# EAGLE design unmask (EAGLE 7.2.0)
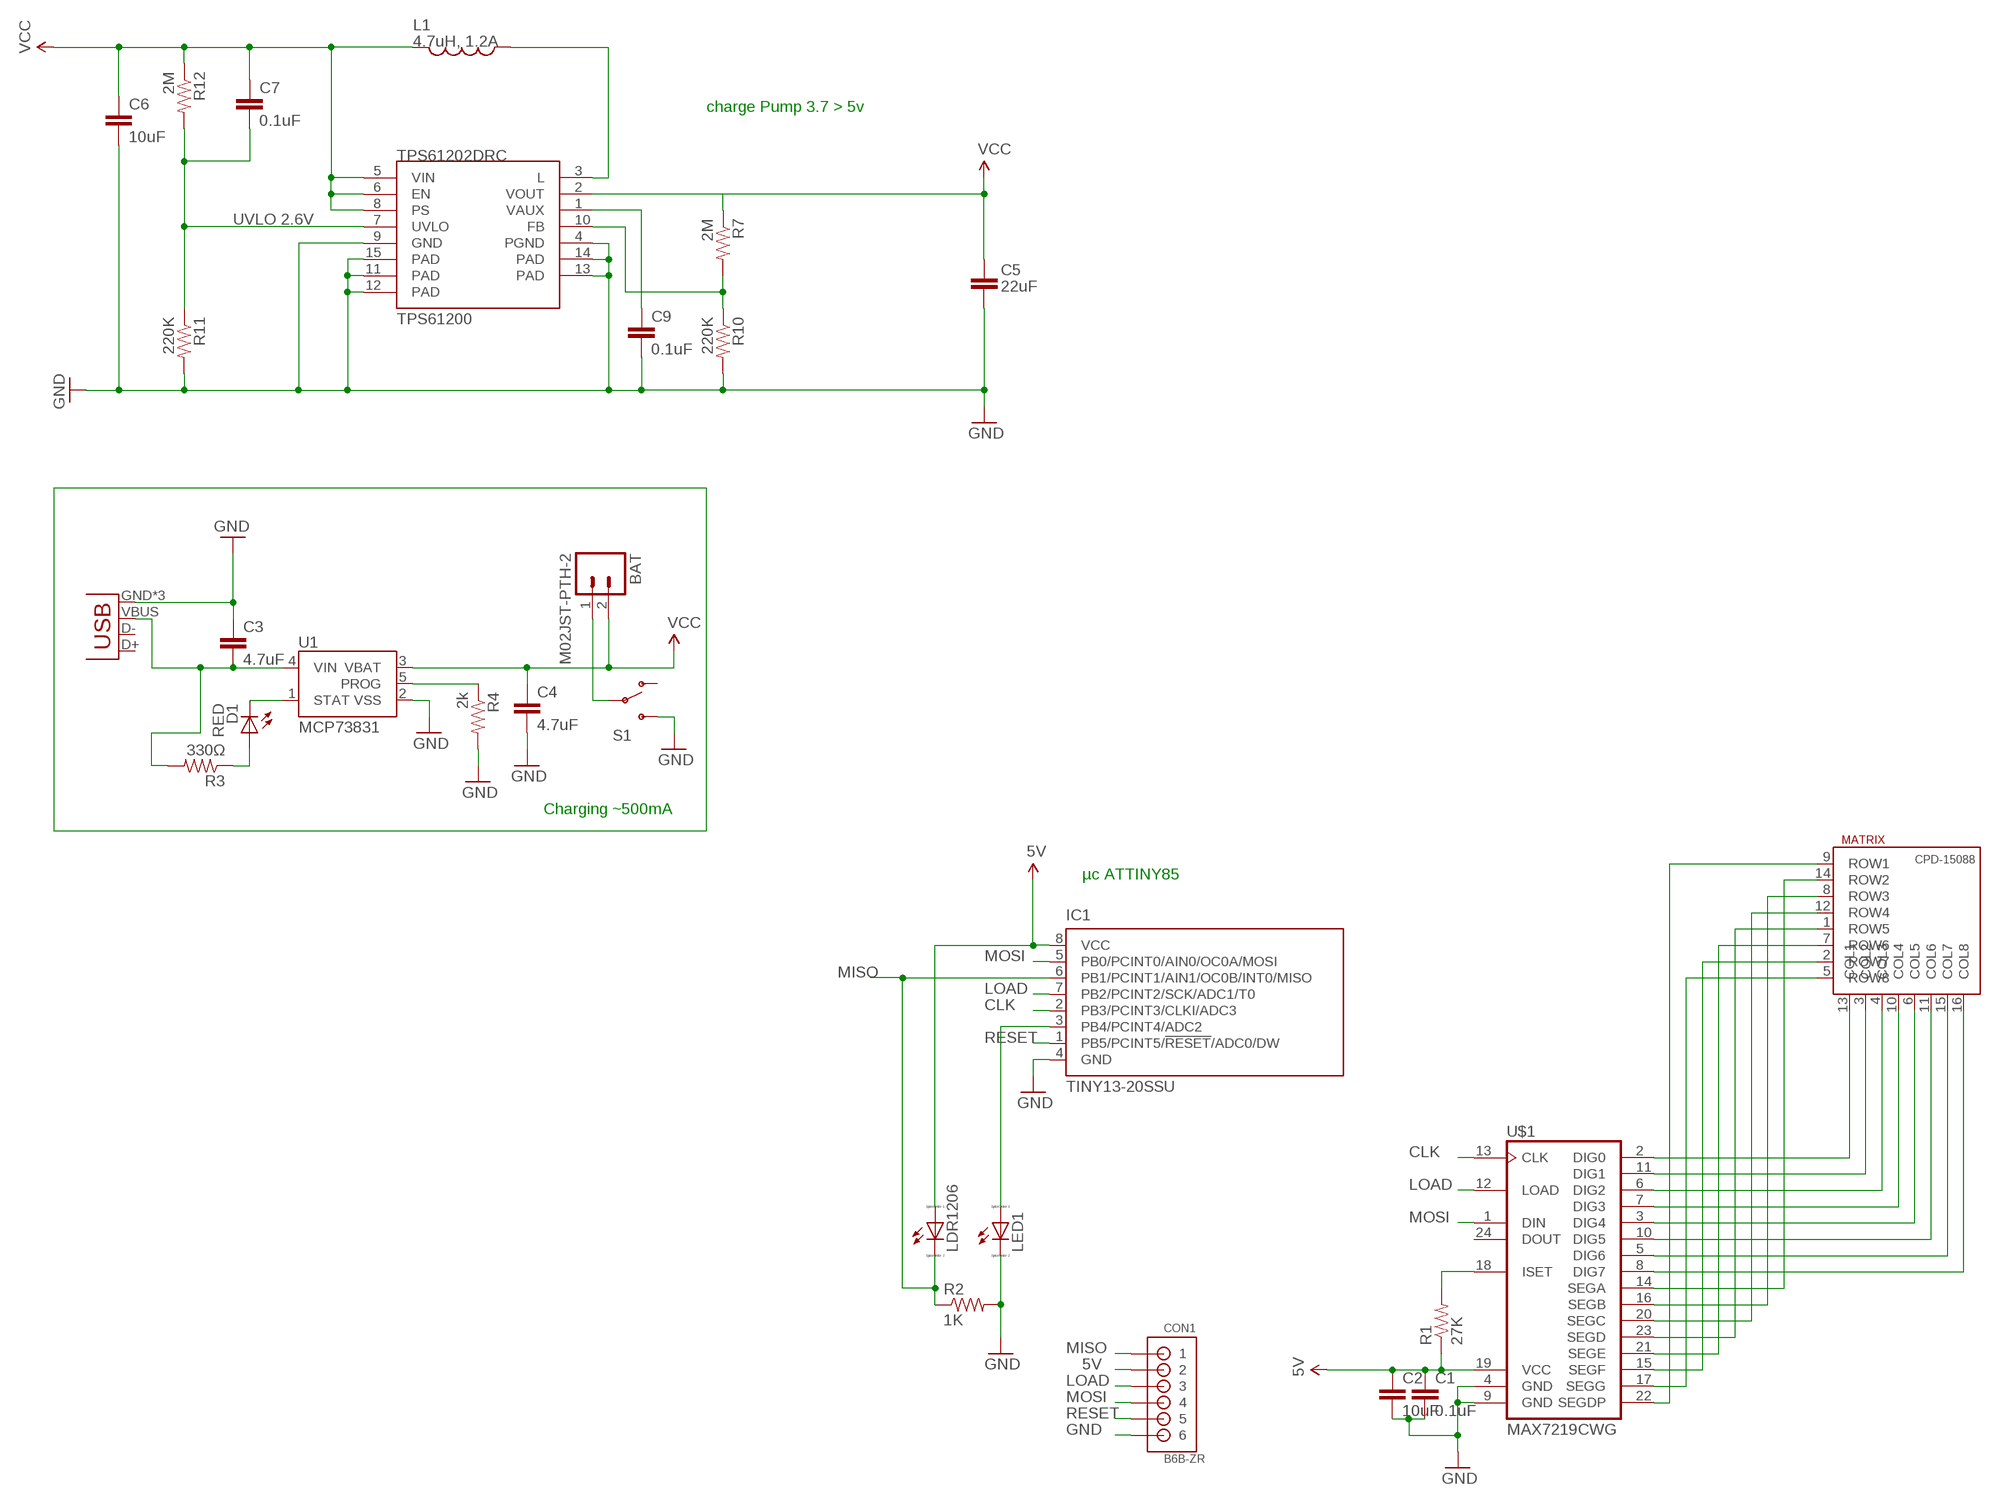
[diagram p0: schematic, sheet 1]

## Parts
BAT  M02JST-PTH-2  [JST-2-PTH]
C1  0.1uF  2.2UF-25V-+80/-20(0805)  [0805]
C2  10uF  2.2UF-25V-+80/-20(0805)  [0805]
C3  4.7uF  22UF-6.3V-20%(0805)  [0805]
C4  4.7uF  22UF-6.3V-20%(0805)  [0805]
C5  22uF  CAP0805  [0805]
C6  10uF  22UF-6.3V-20%(0805)  [0805]
C7  0.1uF  22UF-6.3V-20%(0805)  [0805]
C9  0.1uF  22UF-6.3V-20%(0805)  [0805]
CON1  B6B-ZR  [B6B-ZR]
D1  RED  LED-RED1206  [LED-1206]
IC1  TINY13-20SSU  [8S1]
JP2  USB-MICROB  [USB-MICROB]
L1  4.7uH, 1.2A  INDUCTOR.  [CDRH2D09]
LDR1206  LED_E  [LED_1206]
LED1  LED_E  [LED_1206]
MATRIX  CPD-15088YGD2/A  [CPD15088]
R1  27K  0.75OHM1/4W1%(0805)  [0805]
R2  1K  1.2MOHMS-1/10W-1%(0603)  [0603-RES]
R3  330Ω  0.22OHM1/4W1%(0805)  [0805]
R4  2k  0.22OHM1/4W1%(0805)  [0805]
R7  2M  0.22OHM1/4W1%(0805)  [0805]
R10  220K  0.22OHM1/4W1%(0805)  [0805]
R11  220K  0.22OHM1/4W1%(0805)  [0805]
R12  2M  0.22OHM1/4W1%(0805)  [0805]
S1  SWITCH-SPDTSMD2  [SWITCH-SPDT-SMD]
TPS61202DRC  TPS61200  [QFN-10_PAD]
U1  MCP73831  [SOT23-5]
U$1  MAX7219CWG  [SO24L]

## Nets
5V: C1.1 C2.1 C5.1 CON1.2 IC1.8(VCC) LDR1206.A R1.1 R7.1 R7.2 R10.1 TPS61202DRC.2(VOUT) TPS61202DRC.10(FB) U$1.19(VCC) ; supply symbol labelled VCC
CLK: IC1.2(PB3/PCINT3/CLKI/ADC3) U$1.13(CLK)
GND: C1.2 C2.2 C3.1 C4.2 C5.2 C6.2 C9.2 CON1.6 IC1.4(GND) JP2.GND JP2.MT1(GND) JP2.MT2(GND) R4.2 R10.2 R11.2 S1.3(S) TPS61202DRC.4(PGND) TPS61202DRC.9(GND) TPS61202DRC.11(PAD) TPS61202DRC.12(PAD) TPS61202DRC.13(PAD) TPS61202DRC.14(PAD) TPS61202DRC.15(PAD) U1.2(VSS) U$1.4(GND) U$1.9(GND)
LOAD: CON1.3 IC1.7(PB2/PCINT2/SCK/ADC1/T0) U$1.12(LOAD)
MISO: CON1.1 IC1.6(PB1/PCINT1/AIN1/OC0B/INT0/MISO) LDR1206.C R2.1
MOSI: CON1.4 IC1.5(PB0/PCINT0/AIN0/OC0A/MOSI) U$1.1(DIN)
N$1: MATRIX.2(ROW7) U$1.15(SEGF)
N$2: MATRIX.13(COL1) U$1.2(DIG0)
N$3: MATRIX.3(COL2) U$1.11(DIG1)
N$4: MATRIX.4(COL3) U$1.6(DIG2)
N$5: MATRIX.10(COL4) U$1.7(DIG3)
N$6: MATRIX.6(COL5) U$1.3(DIG4)
N$7: MATRIX.11(COL6) U$1.10(DIG5)
N$8: MATRIX.15(COL7) U$1.5(DIG6)
N$9: MATRIX.16(COL8) U$1.8(DIG7)
N$10: MATRIX.9(ROW1) U$1.22(SEGDP)
N$11: MATRIX.5(ROW8) U$1.17(SEGG)
N$12: MATRIX.7(ROW6) U$1.21(SEGE)
N$13: MATRIX.1(ROW5) U$1.23(SEGD)
N$14: MATRIX.12(ROW4) U$1.20(SEGC)
N$15: MATRIX.8(ROW3) U$1.16(SEGB)
N$16: MATRIX.14(ROW2) U$1.14(SEGA)
N$17: LED1.C R2.2 ; supply symbol labelled GND
N$18: R1.2 U$1.18(ISET)
N$19: IC1.3(PB4/PCINT4/ADC2) LED1.A
N$20: C3.2 JP2.VBUS R3.2 U1.4(VIN)
N$22: D1.C U1.1(STAT)
N$23: D1.A R3.1
N$24: L1.P$1 TPS61202DRC.3(L)
N$25: C9.1 TPS61202DRC.1(VAUX)
N$26: R4.1 U1.5(PROG)
N$27: BAT.1 S1.2(P)
RESET: CON1.5 IC1.1(PB5/PCINT5/!RESET!/ADC0/DW)
UVLO: C7.2 R11.1 R12.2 TPS61202DRC.7(UVLO)
VIN: BAT.2 C4.1 C6.1 C7.1 L1.P$2 R12.1 TPS61202DRC.5(VIN) TPS61202DRC.6(EN) TPS61202DRC.8(PS) U1.3(VBAT) ; supply symbol labelled VCC
Unconnected: JP2.D+ JP2.D- S1.1(O) U$1.24(DOUT)

## Notes on the sheet
- charge Pump 3.7 > 5v
- UVLO 2.6V
- Charging ~500mA
- µc ATTINY85

## Library data of the parts
BAT = SparkFun-Connectors:M02: Standard 2-pin 0.1" header. Use with - straight break away headers ( PRT-00116) - right angle break away headers (PRT-00553) - swiss pins (PRT-00743) - machine pins (PRT-00117) - female headers (PRT-00115) Molex polarized connector foot print use with: PRT-08233 with associated crimp pins and housings. 2.54_SCREWTERM for use with PRT-10571. 3.5mm Screw Terminal footprints for PRT-08084 5mm Screw Terminal footprints for use with PRT-08433; SKU: PRT-09914
C1 C2 = SparkFun-Capacitors:2.2UF-25V-+80/-20(0805): CAP-11624; PROD_ID: CAP-11624; VALUE: 2.2uF
C3 C4 C6 C7 C9 = SparkFun-Capacitors:22UF-6.3V-20%(0805): CAP-08402 Ceramic; PROD_ID: CAP-08402; VALUE: 22uF
C5 = CH_passive:CAP: Capacitor Standard 0603 ceramic capacitor, and 0.1" leaded capacitor.
CON1 = jst:B6B-ZR: JST-ZH Connector 6 pol, 1.5mm pitch Package: B6B-ZR Source: http://www.jst-mfg.com/product/pdf/eng/eZH.pdf
D1 = SparkFun-LED:LED-RED: Assorted Red LEDs LilyPad 1206- DIO-09912 1206- DIO-00809 0603- DIO-00819; PROD_ID: DIO-00809
IC1 = atmel:TINY13: 8-bit AVR Microcontroller with 1K Bytes In-System Programmable Flash Source: http://www.atmel.com/dyn/resources/prod_documents/2535S.pdf; MPN: ATTINY13-20SSU; OC_FARNELL: 1455133; OC_NEWARK: 58M3771
JP2 = SparkFun-Connectors:USB: USB Connectors USB-B-PTH is fully proven SKU : PRT-00139/CONN-08278 USB-miniB is fully proven SKU : PRT-00587 USB-A-PCB is untested. USB-A-H is throughly reviewed, but untested. Spark Fun Electronics SKU : PRT-00437 USB-B-SMT is throughly reviewed, but untested. Needs silkscreen touching up. USB-A-S has not been used/tested USB-MB-H has not been used/tested USB-MICROB has been used. CONN-09505; PROD_ID: CONN-09505
L1 = SparkFun:INDUCTOR: Inductors Basic Inductor/Choke - 0603 and 1206. Footprints are not proven and vary greatly between part numbers.
LDR1206 LED1 = eagle-ltspice:LED_E: LED Source: http://www.osram.convergy.de Source: www.luxeon.com Source: www.kingbright.com; SPICEMODEL: NONE; SPICEPREFIX: D; SPICETYPE: diode
MATRIX = LED:CPD-15088: CPD-15088A YGD2/A Green 8x8 LED matrix
R1 = SparkFun-Resistors:0.75OHM1/4W1%(0805): RES-08474; PROD_ID: RES-08474; VALUE: 0.75
R2 = SparkFun-Resistors:1.2MOHMS-1/10W-1%(0603): RES-10055; PROD_ID: RES-10055; VALUE: 1.2M
R3 R4 R7 R10-R12 = SparkFun-Resistors:0.22OHM1/4W1%(0805): RES-09883; PROD_ID: RES-09883; VALUE: 0.22
S1 = SparkFun-Electromechanical:SWITCH-SPDT: SPDT Switch Simple slide switch, Spark Fun Electronics SKU : COM-00102 DPDT SMT slide switch, AYZ0202, SWCH-08179
TPS61202DRC = SparkFun:TPS61200: DC to DC Booster
U1 = SparkFun-PowerIC:MCP73831: Miniature single cell, fully integrated Li-Ion, Li-polymer charge management controller http://ww1.microchip.com/downloads/en/DeviceDoc/21984a.pdf IC-09995; PROD_ID: IC-09995
U$1 = max7219:MAX7219CWG

## Board
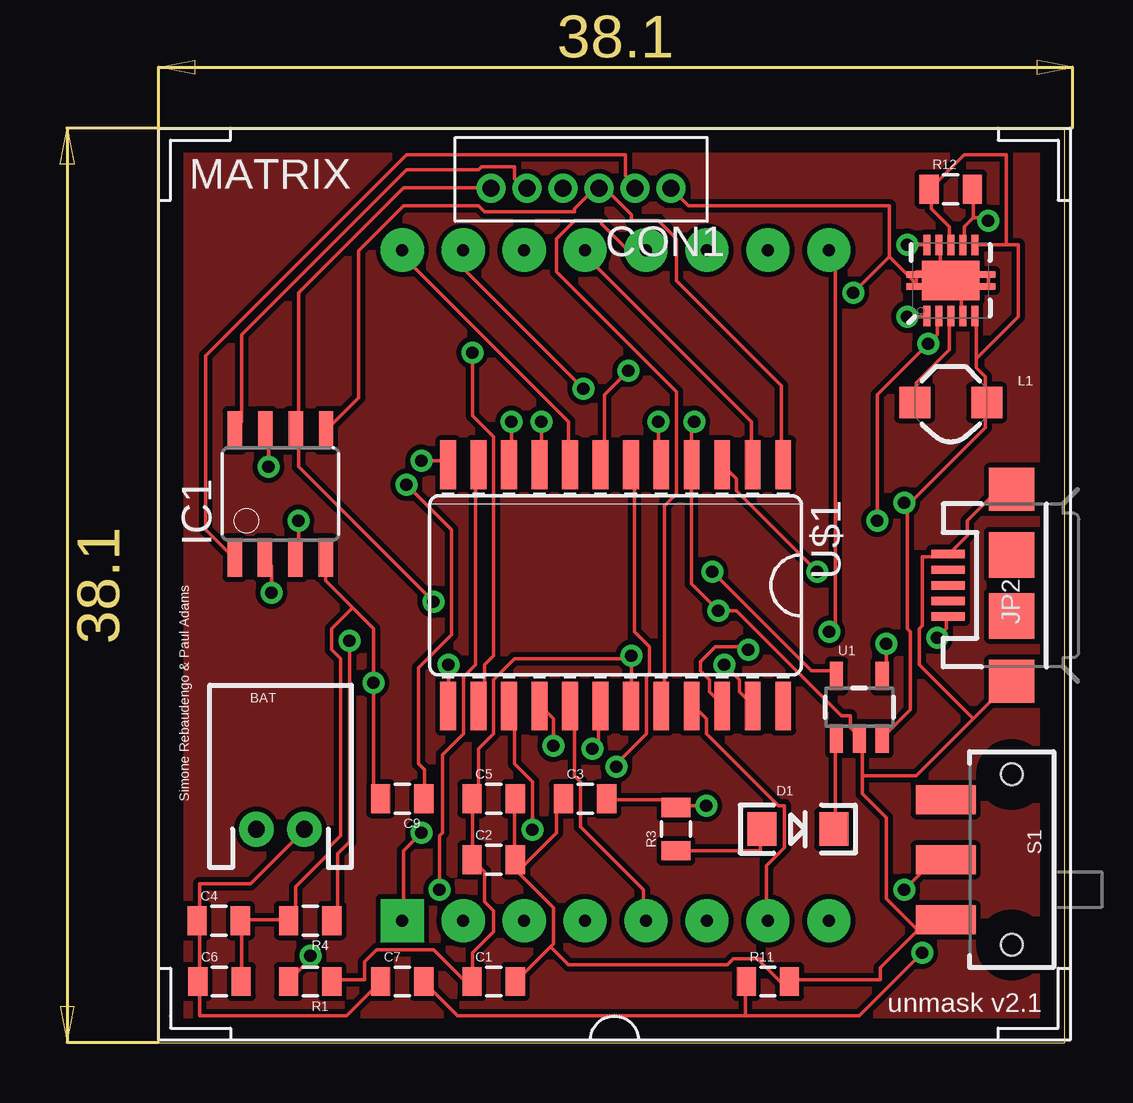
[diagram p1: board, top side]
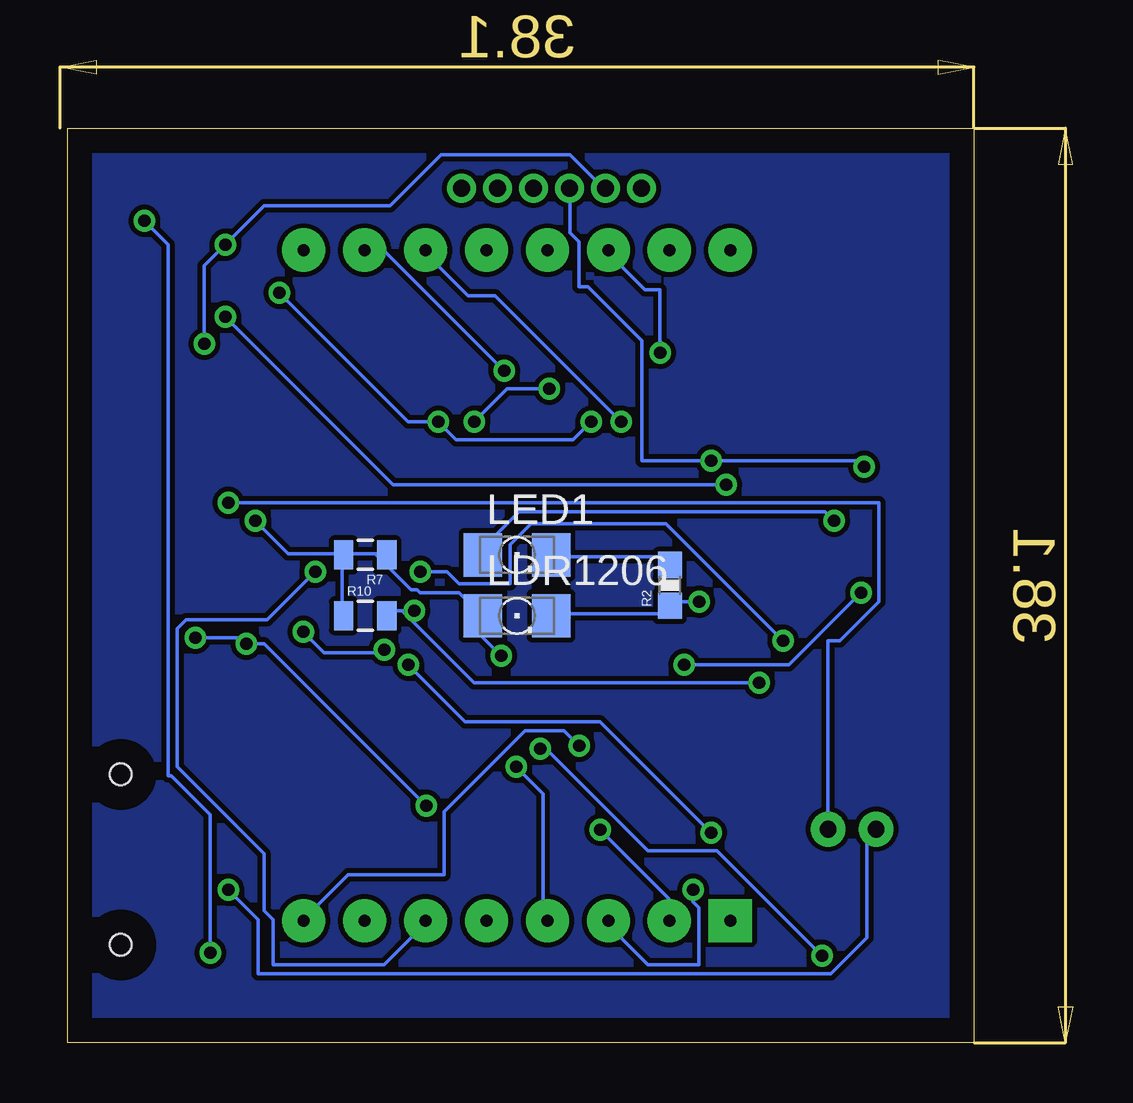
[diagram p2: board, bottom side, seen from below]

Size 42.21 x 40.94 mm. Coordinates in mm from the lower left corner, seen from the top.
Outline: 4.11,0 41.88,0 41.88,38.09 4.11,38.09 4.11,0
Copper layers (1*16): Top 0.035mm / dielectric 1.5mm / Bottom 0.035mm
Design rules "default *": minimum track width 6mil, minimum drill 20mil, track to track 8mil, track to pad 8mil, pad to pad 8mil, via to via 8mil, smd to smd 8mil, copper to edge 40mil, drill to drill 8mil, minimum pad ring 10mil, minimum via ring 8mil, stop-mask expansion 4mil, vias tented up to drill 0mil, thermal gap 10mil

### Footprints (pad centres in the part's own frame; a part is rotated, then mirrored left to right if it is on the bottom)
JST-2-PTH = drill 0.7 pad 1.448: 1 -1,0; 2 1,0
0805 = smd 0.8 x 1.2: 1 -0.9,0; 2 0.9,0
B6B-ZR = drill 0.7: 1 9,-1.3; 2 7.5,-1.3; 3 6,-1.3; 4 4.5,-1.3; 5 3,-1.3; 6 1.5,-1.3
LED-1206 = smd 1.2 x 1.4: A -1.5,0; C 1.5,0
8S1 = smd 0.6 x 1.6: 1 -1.905,-2.654; 2 -0.645,-2.654; 3 0.625,-2.654; 4 1.895,-2.654; 5 1.905,2.654; 6 0.635,2.654; 7 -0.635,2.654; 8 -1.905,2.654
USB-MICROB = smd 0.35 x 1.4: D+ 0,2.65; D- -0.65,2.65; GND 1.3,2.65; ID 0.65,2.65; VBUS -1.3,2.65 | smd 1.8 x 1.9: MT1 -4,0; MT2 4,0 | smd 1.9 x 1.9: P$1 -1.27,0; P$2 1.27,0
CDRH2D09 = smd 1.3 x 1.3: P$1 -1.5,0; P$2 1.5,0
LED_1206 = smd 1.6 x 1.803: A -1.422,0; C 1.422,0
CPD15088 = drill 0.5 pad 1.8 square: 1 10.16,-33.02 | drill 0.5 pad 1.8: 2 12.7,-33.02; 3 15.24,-33.02; 4 17.78,-33.02; 5 20.32,-33.02; 6 22.86,-33.02; 7 25.4,-33.02; 8 27.94,-33.02; 9 27.94,-5.08; 10 25.4,-5.08; 11 22.86,-5.08; 12 20.32,-5.08; 13 17.78,-5.08; 14 15.24,-5.08; 15 12.7,-5.08; 16 10.16,-5.08
0603-RES = smd 1.1 x 1: 1 -0.85,0; 2 0.85,0
SWITCH-SPDT-SMD = smd 1.2 x 2.5: 1 -2.5,-2.75; 2 0,-2.75; 3 2.5,-2.75 | hole 0.9: -3.55,0; 3.55,0
QFN-10_PAD = smd 0.297 x 0.85: 1 -1,-1.475; 2 -0.5,-1.475; 3 0,-1.475; 4 0.5,-1.475; 5 1,-1.475; 6 1,1.475; 7 0.5,1.475; 8 0,1.475; 9 -0.5,1.475; 10 -1,1.475 | smd 0.7 x 0.28: 11 -1.5,0.25; 12 -1.5,-0.25; 13 1.5,0.25; 14 1.5,-0.25 | smd 2.4 x 1.65: 15 0,0
SOT23-5 = smd 0.55 x 1.2: 1 -0.95,-1.3; 2 0,-1.3; 3 0.95,-1.3; 4 0.95,1.3; 5 -0.95,1.3
SO24L = smd 0.66 x 2.032: 1 -6.985,-5.029; 2 -5.715,-5.029; 3 -4.445,-5.029; 4 -3.175,-5.029; 5 -1.905,-5.029; 6 -0.635,-5.029; 7 0.635,-5.029; 8 1.905,-5.029; 9 3.175,-5.029; 10 4.445,-5.029; 11 5.715,-5.029; 12 6.985,-5.029; 13 6.985,5.029; 14 5.715,5.029; 15 4.445,5.029; 16 3.175,5.029; 17 1.905,5.029; 18 0.635,5.029; 19 -0.635,5.029; 20 -1.905,5.029; 21 -3.175,5.029; 22 -4.445,5.029; 23 -5.715,5.029; 24 -6.985,5.029

### Placement (x,y rotation side)
BAT  9.19,8.89 0 top
C1  18.08,2.54 0 top
C2  18.08,7.62 0 top
C3  21.89,10.16 0 top
C4  6.62,5.08 0 top
C5  18.08,10.16 0 top
C6  6.65,2.54 0 top
C7  14.27,2.54 0 top
C9  14.27,10.16 180 top
CON1  26.97,34.29 180 top
D1  30.75,8.89 0 top
IC1  9.19,22.86 0 top
JP2  39.67,19.05 90 top
L1  37.13,26.67 0 top
LDR1206  23.16,17.78 0 bottom
LED1  23.16,20.32 0 bottom
MATRIX  4.11,38.1 0 top
R1  10.43,2.54 180 top
R2  16.78,19.05 90 bottom
R3  25.67,8.89 90 top
R4  10.43,5.08 180 top
R7  29.48,20.32 180 bottom
R10  29.48,17.78 0 bottom
R11  29.51,2.54 0 top
R12  37.13,35.56 0 top
S1  39.67,7.62 270 top
TPS61202DRC  37.13,31.75 0 top
U1  33.32,13.97 0 top
U$1  23.16,19.05 180 top

### Tracks (layer width: path | path; a pad name or v marks a point on that pad's centre or on a via)
5V  (via drill 0.51)
  Top 0.152: IC1.8 7.32,25.62 7.57,25.87 7.57,29.5 14.44,36.37 17.44,36.37 17.57,36.5 18.94,36.5 18.94,36 19.44,35.5 CON1.2 | C2.1 17.19,10.12 C5.1 17.19,10.25 17.44,10.5 17.44,12.25 18.07,12.87 18.07,15.12 18.94,16 23.82,16 | R1.1 11.44,2.62 12.69,2.62 12.69,3.37 13.19,3.87 15.57,3.87 16.82,2.62 17.07,2.62 C1.1 17.19,2.62 17.19,3.75 18.07,4.62 18.07,5.5 17.69,5.87 17.69,7.12 C2.1 | C2.1 | v34.06,21.75 34.06,27 v36.19,29.12 36.56,29.5 36.56,30.25 TPS61202DRC.2 | v35.31,33.25 36.06,33.25 TPS61202DRC.10 | 23.82,16 23.82,14.12 U$1.19 | 23.82,16 v23.82,16.12
  Bottom 0.152: v34.06,21.75 32.69,20.37 30.44,20.37 R7.2 | v36.19,29.12 36.19,32.37 v35.31,33.25 33.69,34.87 28.44,34.87 26.32,37 20.94,37 19.57,35.62 CON1.2 | R10.1 30.44,17.87 30.44,20.25 R7.2 | 29.07,20.37 30.32,20.37 R7.2 | 29.07,20.37 28.69,20.37 R7.1 | 29.07,20.37 27.57,18.87 27.32,18.87 27.19,18.75 25.57,18.75 24.69,17.87 LDR1206.A 24.57,17.75 24.57,16.87 v23.82,16.12
CLK  (via drill 0.51)
  Top 0.152: v8.82,18.75 8.82,19.87 8.57,20.12 IC1.2 | v16.19,15.75 16.19,14.12 U$1.13
  Bottom 0.152: v8.82,18.75 11.82,15.75 v16.19,15.75
GND  (via drill 0.51)
  Top 0.152: C6.2 7.57,2.62 7.57,5 C4.2 7.57,5.12 9.44,5.12 R4.2 9.57,5.12 9.82,5.37 9.82,6.5 11.19,7.87 11.19,8.12 11.69,8.62 11.69,16 11.32,16.37 11.32,17.25 12.19,18.12 | 12.19,18.12 11.07,19.25 11.07,20.12 IC1.4 | 12.19,18.12 13.07,17.25 v13.07,15 13.07,10.5 13.32,10.25 C9.2 | TPS61202DRC.13 38.69,32 38.69,31.62 TPS61202DRC.14 38.56,31.5 37.44,31.5 | 36.69,32.25 36.69,33.12 TPS61202DRC.9 | 36.69,32.25 37.06,31.87 TPS61202DRC.15 | 37.44,31.5 37.19,31.75 TPS61202DRC.15 | 37.44,31.5 37.56,31.37 37.56,30.37 TPS61202DRC.4 | 36.69,32.25 36.69,32.12 35.69,32.12 TPS61202DRC.11 35.69,32 35.69,31.62 TPS61202DRC.12 35.56,31.62 35.56,31.75 34.56,32.75 | 36.69,32.25 TPS61202DRC.15 | 37.44,31.5 TPS61202DRC.15 | CON1.6 26.19,34.87 34.56,34.87 34.56,32.75 | v20.07,25.87 20.07,24.12 U$1.9 | v26.44,25.87 26.32,25.75 26.32,24.12 U$1.4 26.32,24 26.32,19.12 v27.44,18 28.19,18 32.56,13.62 32.94,13.62 32.94,13.12 33.31,12.75 U1.2 33.44,12.62 33.44,11.12 | 20.44,4 20.57,4.12 20.57,5.62 19.07,7.12 | 20.44,4 19.07,2.62 C1.2 | 19.07,7.12 19.07,7.62 C2.2 | C5.2 18.94,10.12 18.94,7.62 C2.2 | 19.07,7.12 20.69,8.75 20.69,9.87 20.94,10.12 C3.1 | 19.07,7.12 C2.2 | JP2.MT2 39.56,23 39.06,23 37.81,21.75 37.81,21.12 37.06,20.37 JP2.GND 36.94,20.25 35.94,20.25 35.94,17.37 35.81,17.25 35.81,15.75 38.06,13.5 | 35.69,4.62 36.19,5.12 S1.3 35.69,4.62 | 35.69,4.62 34.19,3.12 34.19,2.62 30.44,2.62 R11.2 30.32,2.5 30.07,2.5 29.19,3.37 29.19,3.5 28.07,3.5 27.82,3.25 21.19,3.25 20.44,4 | 33.44,11.12 33.44,10.37 34.44,9.37 34.44,6 35.69,4.75 35.69,4.62 | 38.06,13.5 35.69,11.12 33.44,11.12 | 38.06,13.5 39.56,15 JP2.MT1
  Top 0.152: v33.06,31.25 34.56,32.75
  Bottom 0.152: v27.44,18 27.94,18 | 27.94,18 28.44,18 28.57,17.87 R10.2 | v20.07,25.87 20.82,25.12 25.69,25.12 v26.44,25.87 27.69,25.87 v33.06,31.25 | v13.07,15 24.94,15 27.94,18
LOAD  (via drill 0.51)
  Top 0.152: v8.69,24 8.69,25.37 8.57,25.5 IC1.7 | v15.07,24.25 16.07,24.25 16.07,24.12 U$1.12
  Bottom 0.152: v8.69,24 8.94,24.25 v15.07,24.25 17.94,24.25 17.94,29.25 20.19,31.5 20.57,31.5 20.57,33.37 20.94,33.75 20.94,35.5 CON1.3
MISO  (via drill 0.51)
  Top 0.152: CON1.1 17.94,35.62 14.32,35.62 9.94,31.25 9.94,25.62 IC1.6 9.94,25.5 9.94,24 v15.57,18.37
  Bottom 0.152: LDR1206.C 21.69,17.87 17.07,17.87 16.82,18.12 R2.1 16.69,18.25 16.57,18.37 v15.57,18.37
MOSI
  Top 0.152: IC1.5 11.19,25.62 12.44,26.87 12.44,33 14.32,34.87 17.44,34.87 17.69,34.62 21.44,34.62 21.44,34.75 22.19,35.5 22.44,35.5 CON1.4 22.57,35.5 22.82,35.5 23.82,34.5 23.82,34.25 24.94,34.25 25.69,33.5 25.69,31.75 30.07,27.37 30.07,24.12 U$1.1
N$1  (via drill 0.51)
  Top 0.152: v19.69,8.87 19.69,10.87 18.94,11.62 18.94,13.87 18.82,14 U$1.15
  Bottom 0.152: v19.69,8.87 16.82,6 16.82,5.12 MATRIX.2
N$2
  Top 0.152: U$1.2 28.82,24.12 28.82,25.87 21.94,32.75 21.94,33 MATRIX.13
N$3  (via drill 0.51)
  Top 0.152: v15.82,6.37 15.82,8.62 15.94,8.75 15.94,12 16.82,12.87 16.82,15.25 17.32,15.75 17.32,23.87 17.44,24 U$1.11
  Bottom 0.152: v15.82,6.37 15.82,5.87 15.57,5.62 15.57,3.25 17.69,3.25 19.44,5 MATRIX.3
N$4  (via drill 0.51)
  Top 0.152: v23.19,11.5 23.19,11.62 24.44,12.87 24.44,15.25 24.57,15.37 24.57,16.5 23.94,17.12 23.94,23.87 23.82,24 U$1.6
  Bottom 0.152: v23.19,11.5 22.07,10.37 22.07,5.12 21.94,5.12 MATRIX.4
N$5  (via drill 0.51)
  Top 0.152: v23.69,28 22.69,27 22.69,24.25 22.57,24.12 U$1.7
  Bottom 0.152: v23.69,28 28.69,33 29.44,33 MATRIX.10
N$6  (via drill 0.51)
  Top 0.152: v31.57,19.62 28.19,23 28.19,23.5 27.69,24 U$1.3
  Bottom 0.152: v31.57,19.62 33.56,17.62 36.94,17.62 37.31,17.25 37.31,11.5 33.69,7.87 33.69,5.5 33.31,5.12 33.31,3.25 28.69,3.25 26.94,5 MATRIX.6
N$7  (via drill 0.51)
  Top 0.152: v18.82,25.87 18.82,24.12 U$1.10
  Bottom 0.152: v18.82,25.87 24.07,31.12 25.19,31.12 27.07,33 MATRIX.11
N$8  (via drill 0.51)
  Top 0.152: v24.94,25.87 24.94,24.25 25.07,24.12 U$1.5 | v21.82,27.25 16.82,32.25 16.82,33 MATRIX.15
  Bottom 0.152: v24.94,25.87 23.57,27.25 v21.82,27.25
N$9
  Top 0.152: U$1.8 21.19,24.12 21.19,25.87 14.32,32.75 14.32,33 MATRIX.16
N$10  (via drill 0.51)
  Top 0.152: v28.69,16.37 28.69,16.5 27.32,16.5 26.69,15.87 26.69,15.5 27.07,15.12 27.07,14.62 27.57,14.12 U$1.22 | v32.06,17.12 32.31,17.37 32.31,32.75 32.06,33 MATRIX.9
  Bottom 0.152: v28.69,16.37 28.82,16.25 31.19,16.25 v32.06,17.12
N$11
  Top 0.152: U$1.17 21.32,14 21.44,13.87 21.44,11.12 21.69,10.87 21.69,9 24.32,6.37 24.32,5.12 MATRIX.5
N$12
  Top 0.152: U$1.21 26.44,14 26.94,13.5 26.94,12.87 29.94,9.87 30.19,9.87 30.19,8.12 29.44,7.37 29.44,5.12 MATRIX.7
N$13  (via drill 0.51)
  Top 0.152: v27.69,15.75 28.32,15.12 28.32,14.62 28.82,14.12 U$1.23 | v15.07,8.75 14.32,8 14.32,5.12 MATRIX.1
  Bottom 0.152: v27.69,15.75 25.32,13.37 19.69,13.37 v15.07,8.75
N$14
  Top 0.152: U$1.20 25.07,14.12 25.19,14.25 25.19,22.37 25.69,22.87 25.69,27.12 20.69,32.12 20.69,33.5 21.44,34.25 22.57,34.25 22.57,34.12 23.57,33.12 24.32,33.12 MATRIX.12
N$15  (via drill 0.51)
  Top 0.152: v20.57,12.37 20.57,13.5 20.07,14 U$1.16
  Bottom 0.152: v20.57,12.37 21.19,13 22.82,13 26.19,9.62 26.19,7 30.19,7 32.06,5.12 MATRIX.8
N$16  (via drill 0.51)
  Top 0.152: v17.19,28.75 17.19,26.12 18.07,25.25 18.07,16.12 17.69,15.75 17.69,14.25 17.57,14.12 U$1.14
  Bottom 0.152: v17.19,28.75 17.19,31.37 17.82,31.37 19.44,33 MATRIX.14
N$17
  Bottom 0.152: R2.2 16.82,20 17.07,20.25 21.69,20.25 LED1.C
N$18  (via drill 0.51)
  Top 0.152: v10.44,3.62 10.44,3.5 9.57,2.62 R1.2 | v22.19,12.25 22.44,12.5 22.44,14 U$1.18
  Bottom 0.152: v10.44,3.62 14.82,8 17.69,8 21.94,12.25 v22.19,12.25
N$19  (via drill 0.51)
  Top 0.152: v9.94,21.75 9.94,20.37 9.82,20.25 IC1.3
  Bottom 0.152: v9.94,21.75 10.32,22.12 23.07,22.12 24.57,20.62 24.57,20.37 LED1.A
N$20  (via drill 0.51)
  Top 0.152: C3.2 22.82,10.12 25.57,10.12 25.57,9.87 R3.2 25.69,9.87 v26.94,9.87 | v34.44,16.62 34.44,15.5 34.31,15.37 U1.4 | v36.56,16.87 36.94,17.25 36.94,17.75 JP2.VBUS
  Bottom 0.152: v36.56,16.87 34.69,16.87 v34.44,16.62 33.69,16.62 v26.94,9.87
N$21
  pour Top: 4.11,38.1 42.21,38.1 42.21,0 4.11,0
N$22
  Top 0.152: U1.1 32.31,12.62 32.31,9 D1.C
N$23
  Top 0.152: R3.1 25.69,8 29.19,8 29.19,8.87 D1.A
N$24
  Top 0.152: TPS61202DRC.3 37.06,30.25 37.06,28.87 35.69,27.5 35.69,26.75 L1.P$1
N$25  (via drill 0.51)
  Top 0.152: v35.31,30.25 36.06,30.25 TPS61202DRC.1 | v14.44,23.25 16.32,21.37 16.32,17 14.94,15.62 14.94,11.62 15.19,11.37 15.19,10.25 C9.1
  Bottom 0.152: v35.31,30.25 28.32,23.25 v14.44,23.25
N$26  (via drill 0.51)
  Top 0.152: v12.07,16.75 12.07,8.37 11.57,7.87 11.57,5.25 11.44,5.12 R4.1 | v27.19,19.62 31.32,15.5 32.31,15.5 32.31,15.37 U1.5
  Bottom 0.152: v12.07,16.75 16.94,21.62 22.57,21.62 23.44,20.75 23.44,19.12 25.57,19.12 26.07,19.62 v27.19,19.62
N$27  (via drill 0.51)
  Top 0.152: S1.2 35.81,7.62 35.81,7 v35.19,6.37
  Bottom 0.152: v35.19,6.37 33.94,5.12 33.94,2.87 10.07,2.87 8.57,4.37 8.57,8.87 8.19,8.87 BAT.1
N$28
  pour Bottom: 4.11,38.1 42.21,38.1 42.21,0 4.11,0
RESET
  Top 0.152: IC1.1 7.19,20.25 6.07,21.37 6.07,28.62 14.44,37 23.57,37 23.57,36.12 23.94,35.75 23.94,35.62 CON1.5
UVLO  (via drill 0.51)
  Top 0.152: 38.06,34.37 37.69,34 37.69,33.25 TPS61202DRC.7 | 38.06,34.37 38.06,35.5 R12.2 | 28.57,1.12 16.57,1.12 15.19,2.5 C7.2 | 28.57,1.12 28.57,2.5 R11.1 | 38.06,34.37 38.69,34.37 v38.69,34.25 | v35.94,3.75 33.31,1.12 28.57,1.12
  Bottom 0.152: v38.69,34.25 37.69,33.25 37.69,11.12 37.56,11.12 35.94,9.5 v35.94,3.75
VIN  (via drill 0.51)
  Top 0.152: C7.1 13.32,2.5 11.94,1.12 5.82,1.12 5.82,2.5 C6.1 5.82,2.62 5.82,5 C4.1 5.82,5.12 5.82,6.62 7.94,6.62 10.19,8.87 BAT.2 | TPS61202DRC.8 37.06,33.25 37.06,34 36.31,34.75 36.31,35.5 R12.1 36.31,35.62 37.69,37 39.44,37 39.44,33.25 | 38.19,28.5 38.19,28.12 38.56,27.75 38.56,26.75 L1.P$2 38.56,26.62 38.56,25.62 35.31,22.37 | 38.19,28.5 38.19,30.25 TPS61202DRC.5 | 39.44,33.25 39.94,33.25 39.94,30.25 38.19,28.5 | 39.44,33.25 38.19,33.25 TPS61202DRC.6 | 35.31,22.37 35.31,17.25 35.44,17.12 35.44,13.87 34.31,12.75 U1.3 | 35.31,22.37 v35.19,22.5
  Bottom 0.152: BAT.2 10.19,16.75 9.69,16.75 8.07,18.37 8.07,22.5 v35.19,22.5

### Text on the board
tPlace: Simone Rebaudengo & Paul Adams | unmask v2.1